# Altium schematic sheet TPS54360.SchDoc
size A4; SheetNumber: 2; SheetTotal: 2
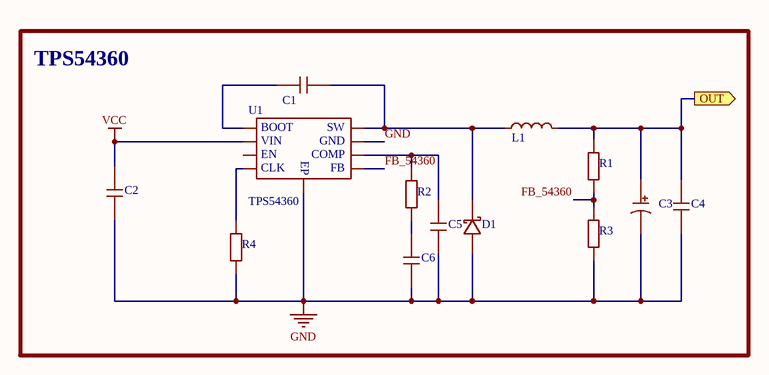
[diagram p0: TPS54360.SchDoc]

## Parts
C1  100nF  [0603C]  (value not drawn)
C2  4.7uF  [0805C]  (value not drawn)
C3  钽电容  [3528B/1210]  (value not drawn)
C4  47uF  [0805C]  (value not drawn)
C5  4.7nF  [0603C]  (value not drawn)
C6  4.7nF  [0603C]  (value not drawn)
D1  SS56  [SMA]  (value not drawn)
L1  10uH  [0630L]  (value not drawn)
R1  60.4K  [0603R]  (value not drawn)
R2  28.7K  [0603R]  (value not drawn)
R3  11.5K  [0603R]  (value not drawn)
R4  124K  [0603R]  (value not drawn)
U1  TPS54360  [SOP-8-PP]

## Blocks framed on the sheet
TPS54360: C1-C6 D1 L1 R1-R4 U1

## Ports
OUT (out)

## Nets
GND: C2.1 C3.2 C4.1 C5.2 C6.2 D1.1 R3.1 R4.1 U1.7 U1.9
VCC: C2.2 U1.2
FB_54360: R1.1 R3.2 U1.5
OUT: C3.1 C4.2 L1.2 R1.2 ; port OUT
NetC1_1: C1.1 D1.2 L1.1 U1.8
NetC1_2: C1.2 U1.1
NetC5_1: C5.1 R2.2 U1.6
NetC6_1: C6.1 R2.1
NetR4_2: R4.2 U1.4

Not connected (* = marked no-connect by the designer): U1 3

## Notes on the sheet
- (in symbol 芯片/IC-电源管理-TPS54360) BOOT; SW; VIN; GND; EN; COMP; EP; CLK; FB

## Library data of the parts
C1 C2 C4-C6 = 电容_贴片
C3 = 电容_贴片钽
D1 = 二极管_肖特基
L1 = 电感_贴片
R1-R4 = 电阻_贴片
U1 = 芯片/IC-电源管理-TPS54360